# Altium schematic sheet Consult.SchDoc
size A3; SheetNumber: 1; SheetTotal: 1
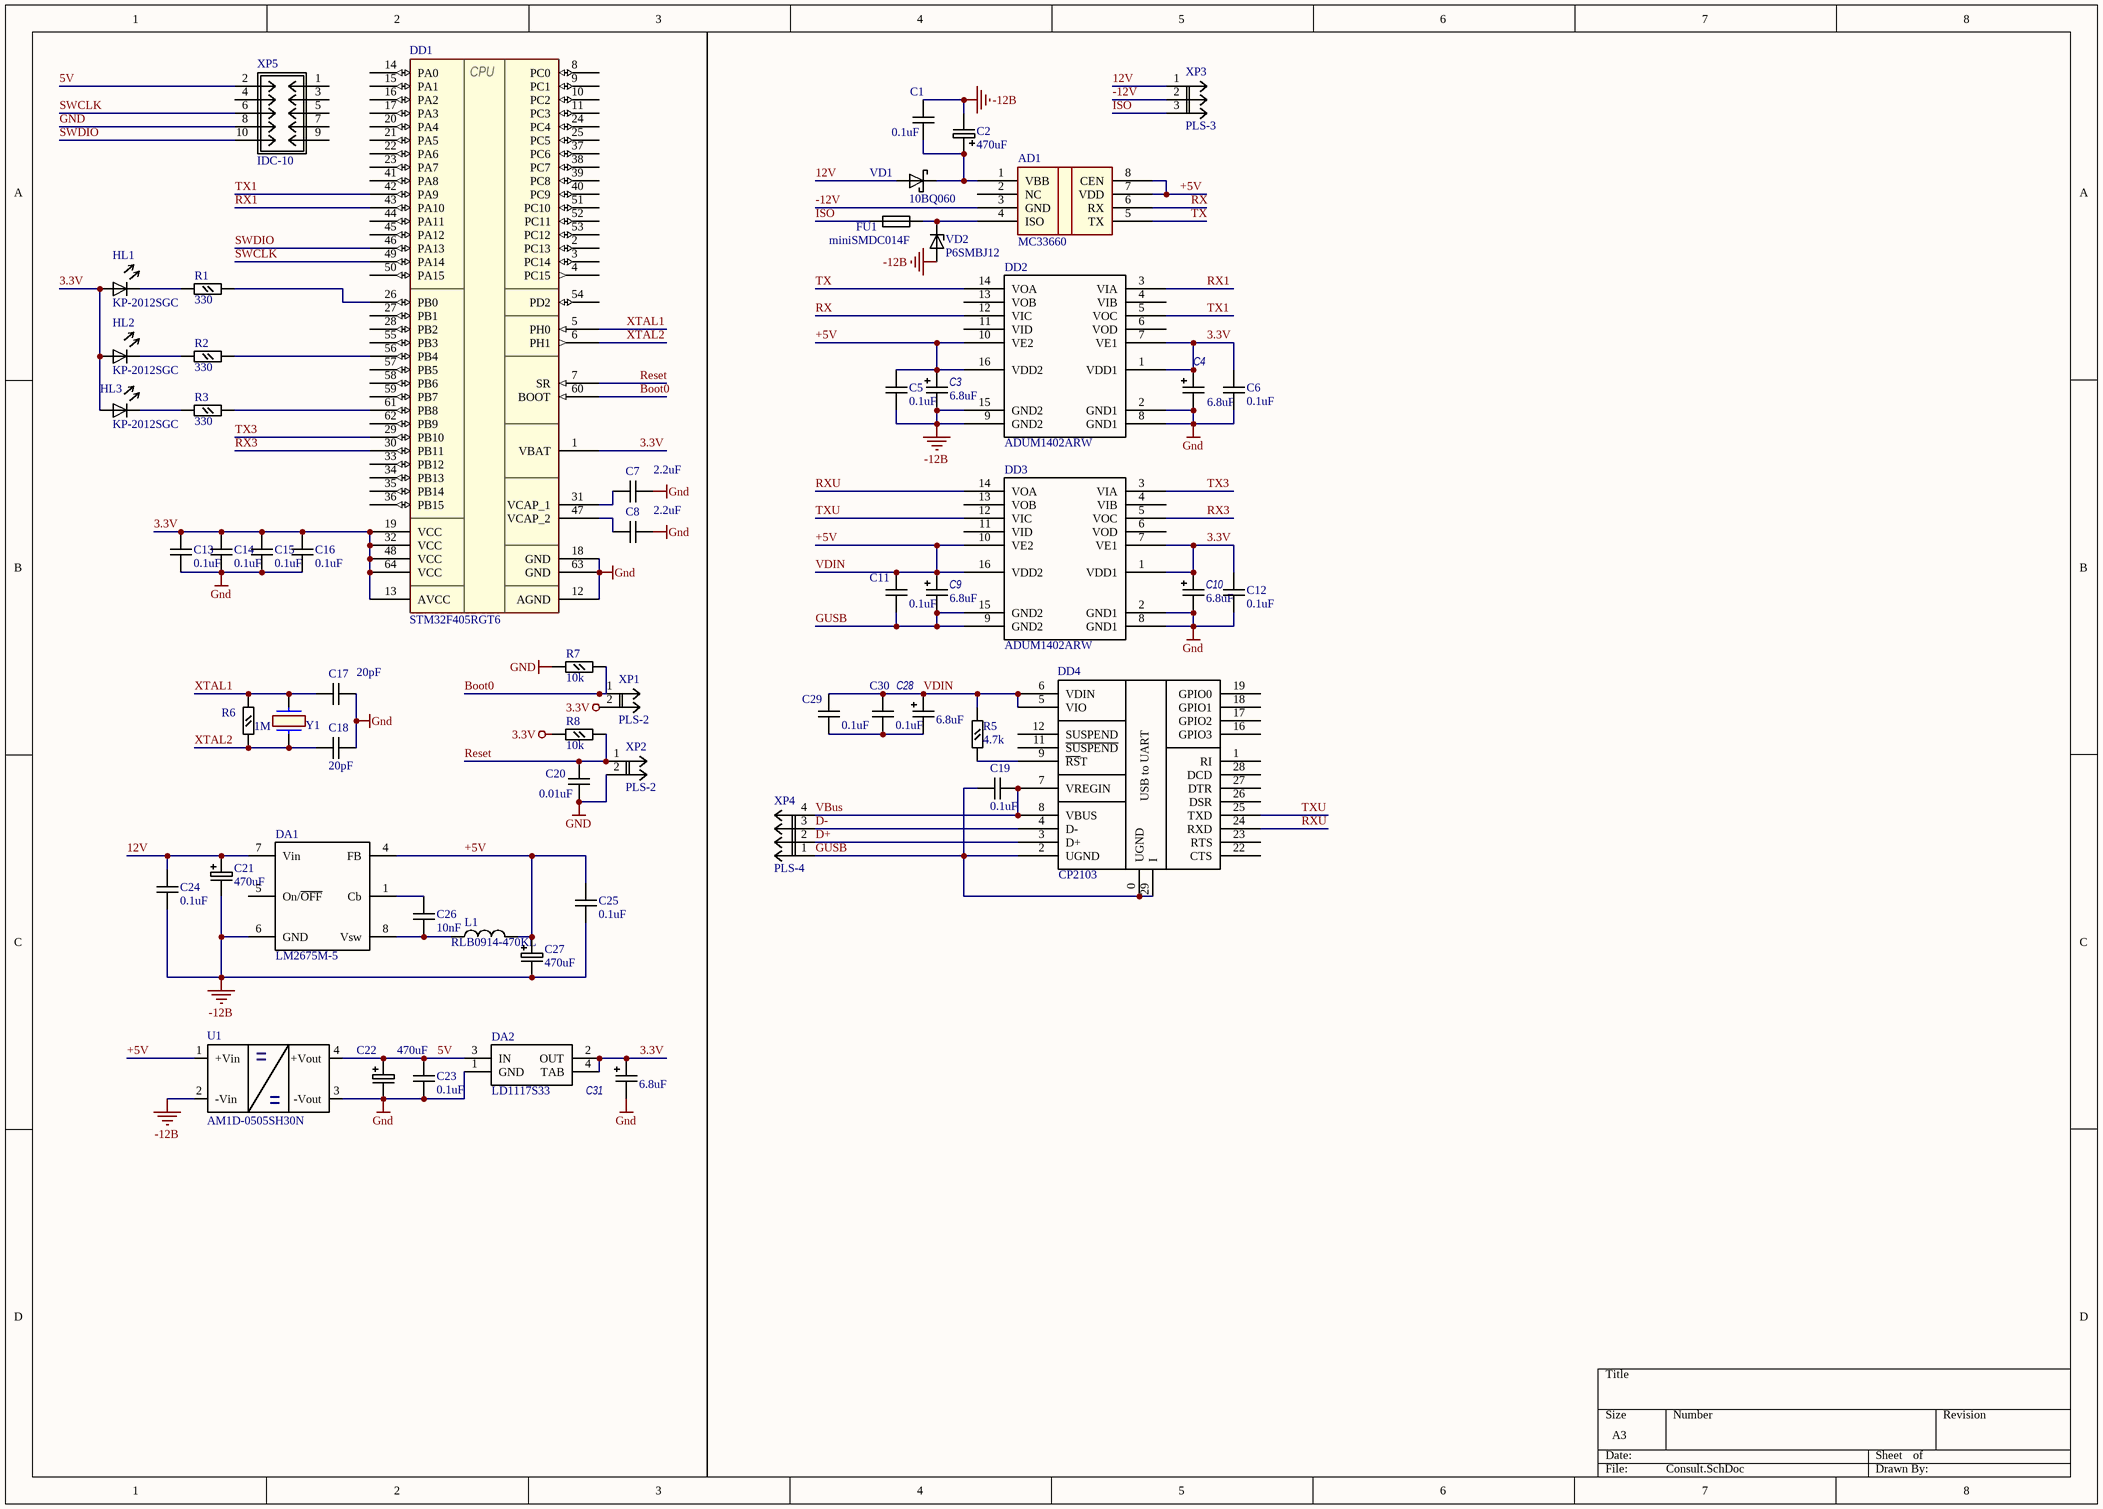
[diagram p0: Consult.SchDoc]

## Parts
AD1  MC33660  [SO-8_M]
C1  0.1uF  [cap0805]
C2  470uF  [ECR-EHR 10mm]
C3  6.8uF  [TC3216-1206-A]
C4  6.8uF  [TC3216-1206-A]
C5  0.1uF  [cap0805]
C6  0.1uF  [cap0805]
C7  2.2uF  [cap0805]
C8  2.2uF  [cap0805]
C9  6.8uF  [TC3216-1206-A]
C10  6.8uF  [TC3216-1206-A]
C11  0.1uF  [cap0805]
C12  0.1uF  [cap0805]
C13  0.1uF  [cap0805]
C14  0.1uF  [cap0805]
C15  0.1uF  [cap0805]
C16  0.1uF  [cap0805]
C17  20pF  [cap0805]
C18  20pF  [cap0805]
C19  0.1uF  [cap0805]
C20  0.01uF  [cap0805]
C21  470uF  [ECR-EHR 10mm]
C22  470uF  [ECR-EHR 10mm]
C23  0.1uF  [cap0805]
C24  0.1uF  [cap0805]
C25  0.1uF  [cap0805]
C26  10nF  [cap0805]
C27  470uF  [ECR-EHR 10mm]
C28  6.8uF  [TC3216-1206-A]
C29  0.1uF  [cap0805]
C30  0.1uF  [cap0805]
C31  6.8uF  [TC3216-1206-A]
DA1  LM2675M-5  [SO-8]
DA2  LD1117S33  [SOT223]
DD1  STM32F405RGT6  [LQFP64]
DD2  ADUM1402ARW  [WSO-16]
DD3  ADUM1402ARW  [WSO-16]
DD4  CP2103  [QFN-28]
FU1  miniSMDC014F  [1812]
HL1  KP-2012SGC  [Led0805]
HL2  KP-2012SGC  [Led0805]
HL3  KP-2012SGC  [Led0805]
L1  RLB0914-470KL  [RLB0914]
R1  330  [res0805]
R2  330  [res0805]
R3  330  [res0805]
R5  4.7k  [res0805]
R6  1M  [res0805]
R7  10k  [res0805]
R8  10k  [res0805]
U1  AM1D-0505SH30N  [SIP7S]
VD1  10BQ060  [SMB]
VD2  P6SMBJ12  [SMB]
XP1  PLS-2  [PLS2]
XP2  PLS-2  [PLS2]
XP3  PLS-3  [PLS3]
XP4  PLS-4  [PLS4]
XP5  IDC-10  [IDC-10]
Y1  8MHz  [XT49M]  (value not drawn)

## Nets
3.3V: C4.1 C6.1 C10.1 C12.1 C13.1 C14.1 C15.1 C16.1 C31.1 DA2.2(OUT) DA2.4(TAB) DD1.1(VBAT) DD1.13(AVCC) DD1.19(VCC) DD1.32(VCC) DD1.48(VCC) DD1.64(VCC) DD2.1(VDD1) DD2.7(VE1) DD3.1(VDD1) DD3.7(VE1) HL1.1(A) HL2.1(A) HL3.1(A) R8.2
+5V: AD1.7(VDD) AD1.8(CEN) C3.1 C5.1 C9.1 C11.1 C25.1 C27.1 C28.1 C29.1 C30.1 DA1.4(FB) DD2.10(VE2) DD2.16(VDD2) DD3.10(VE2) DD3.16(VDD2) DD4.5(VIO) DD4.6(VDIN) DD4.10(VDIN) DD4.13(VDIN) DD4.14(VDIN) DD4.15(VDIN) DD4.20(VDIN) DD4.21(VDIN) L1.2 R5.2 U1.1(+Vin)  [also labelled VDIN]
-12B: C1.2 C2.2 C3.2 C5.2 C21.2 C24.2 C25.2 C27.2 DA1.6(GND) DD2.9(GND2) DD2.15(GND2) U1.2(-Vin) VD2.1(A)
GND: C4.2 C6.2 C7.2 C8.2 C10.2 C12.2 C13.2 C14.2 C15.2 C16.2 C17.2 C18.2 C20.2 C22.2 C23.2 C31.2 DA1.2(GND) DA1.3(GND) DA2.1(GND) DD1.12(AGND) DD1.18(GND) DD1.63(GND) DD2.2(GND1) DD2.8(GND1) DD3.2(GND1) DD3.8(GND1) R7.2 U1.3(-Vout) XP2.2 XP5.8
5V: C22.1 C23.1 DA2.3(IN) U1.4(+Vout) XP5.2
12V: C21.1 C24.1 DA1.7(Vin) VD1.1(A) XP3.1
-12V: AD1.3(GND) XP3.2
Boot0: DD1.60(BOOT) R7.1 XP1.1
D+: DD4.3(D+) XP4.2
D-: DD4.4(D-) XP4.3
GUSB: C9.2 C11.2 C19.1 DD3.9(GND2) DD3.15(GND2) DD4.0(UGND) DD4.2(UGND) DD4.29(I) XP4.1
ISO: FU1.1 XP3.3
Reset: C20.1 DD1.7(SR) R8.1 XP2.1
RX: AD1.6(RX) DD2.12(VIC)
RX1: DD1.43(PA10) DD2.3(VIA)
RX3: DD1.30(PB11) DD3.5(VOC)
RXU: DD3.14(VOA) DD4.24(RXD)
SWCLK: DD1.49(PA14) XP5.6
SWDIO: DD1.46(PA13) XP5.10
TX: AD1.5(TX) DD2.14(VOA)
TX1: DD1.42(PA9) DD2.5(VOC)
TX3: DD1.29(PB10) DD3.3(VIA)
TXU: DD3.12(VIC) DD4.25(TXD)
VBus: C19.2 DD4.7(VREGIN) DD4.8(VBUS) XP4.4
XTAL1: C17.1 DD1.5(PH0) R6.2 Y1.2(L2)
XTAL2: C18.1 DD1.6(PH1) R6.1 Y1.1(L1)
NetAD1_1: AD1.1(VBB) C1.1 C2.1 VD1.2(K)
NetAD1_4: AD1.4(ISO) FU1.2 VD2.2(K)
NetC7_1: C7.1 DD1.31(VCAP_1)
NetC8_1: C8.1 DD1.47(VCAP_2)
NetC26_1: C26.1 DA1.1(Cb)
NetC26_2: C26.2 DA1.8(Vsw) L1.1
NetC28_2: C28.2 C29.2 C30.2
NetDD1_26: DD1.26(PB0) R1.2
NetDD1_56: DD1.56(PB4) R2.2
NetDD1_61: DD1.61(PB8) R3.2
NetDD4_9: DD4.9(~{RS}T) R5.1
NetHL1_2: HL1.2(K) R1.1
NetHL2_2: HL2.2(K) R2.1
NetHL3_2: HL3.2(K) R3.1

Not connected (* = marked no-connect by the designer): AD1 2(NC); DA1 5(On/~{OFF}); DD1 2(PC13) 3(PC14) 4(PC15) 8(PC0) 9(PC1) 10(PC2) 11(PC3) 14(PA0) 15(PA1) 16(PA2) 17(PA3) 20(PA4) 21(PA5) 22(PA6) 23(PA7) 24(PC4) 25(PC5) 27(PB1) 28(PB2) 33(PB12) 34(PB13) 35(PB14) 36(PB15) 37(PC6) 38(PC7) 39(PC8) 40(PC9) 41(PA8) 44(PA11) 45(PA12) 50(PA15) 51(PC10) 52(PC11) 53(PC12) 54(PD2) 55(PB3) 57(PB5) 58(PB6) 59(PB7) 62(PB9); DD2 4(VIB) 6(VOD) 11(VID) 13(VOB); DD3 4(VIB) 6(VOD) 11(VID) 13(VOB); DD4 1(RI) 11(~{SUSPEND}) 12(SUSPEND) 16(GPIO3) 17(GPIO2) 18(GPIO1) 19(GPIO0) 22(CTS) 23(RTS) 26(DSR) 27(DTR) 28(DCD); XP1 2; XP5 1 3 4 5 7 9

## Notes on the sheet
- Labels drawn without touching a wire or pin: 3.3V
- (in symbol CP2103) USB to UART
- (in symbol STM32F405RGT6) CPU

## Library data of the parts
C1 C5-C8 C11-C20 C23-C26 C29 C30 = cap0805: Керамический конденсатор, SMD; Group: Конденсаторы; NPads: 2; Part Number: cap0805; SType: SMD; Package: SMD 0805
  C1 C5 C6 C11-C16 C19 C23-C25 C29 C30: ValueSCH: 0.1uF
  C7 C8: ValueSCH: 2.2uF
  C17 C18: ValueSCH: 20pF
  C20: ValueSCH: 0.01uF
  C26: ValueSCH: 10nF
C2 C21 C22 C27 = ECR/EHR/EXR D=10mm: Алюминиевый конденсатор Hitano; Group: Конденсаторы; SType: TH; NPads: 2; Part Number: ECR/EHR/EXR D=10mm; ValueSCH: 470uF; Package: ECR/HER
C3 C4 C9 C10 C28 C31 = capA: Танталовый конденсатор, SMD; Part Number: capA; Group: Конденсаторы; NPads: 2; ValueSCH: 6.8uF; SType: SMD; Package: SMD A
DA1 = LM2675M-5: Понижающий DC-DC 5V 1А; Group: Микросхемы; SType: SMD; NPads: 8; Part Number: LM2675M-5; ValueSCH: LM2675M-5; Package: SO-8
DA2 = LD1117S33: Линейный стабилизатор 3.3V; Group: Микросхемы; SType: SMD; NPads: 4; Part Number: LD1117S33; ValueSCH: LD1117S33; Package: SOT223
DD1 = STM32F405RGT6: Микроконтроллер 32 бит CORTEX M4; Group: Микросхемы; SType: SMD; NPads: 64; Part Number: STM32F405RGT6; ValueSCH: STM32F405RGT6; Package: LQFP64
DD2 DD3 = ADUM1402ARW: Цифровой оптрон 4 канала; Group: Микросхемы; SType: SMD; NPads: 16; Part Number: ADUM1402ARW; ValueSCH: ADUM1402ARW; Package: SO-16W
DD4 = CP2103: Чип USB -> UART; Group: Микросхемы; SType: SMD; NPads: 28; Part Number: CP2103; ValueSCH: CP2103; Package: QFN-28
FU1 = miniSMDC014F: SMD Предохранитель 0.14А 60B; NPads: 2; Part Number: miniSMDC014F; ValueSCH: miniSMDC014F; Group: Предохранитель; SType: SMD; Package: smd1812
HL1-HL3 = KP-2012SGC: SMD светодиод зеленый; Group: Диоды; NPads: 2; Part Number: KP-2012SGC; ValueSCH: KP-2012SGC; SType: SMD; Package: SMD 0805
L1 = RLB0914-470KL: Group: Индуктивности; SType: TH; NPads: 2; Part Number: RLB0914-470KL; ValueSCH: RLB0914-470KL; Package: RLB0914
R1-R3 R5-R8 = res0805: Резистор 0.125 W, SMD; Group: Резисторы; NPads: 2; Part Number: res0805; SType: SMD; Package: SMD 0805
  R1-R3: ValueSCH: 330
  R5: ValueSCH: 4.7k
  R6: ValueSCH: 1M
  R7 R8: ValueSCH: 10k
U1 = AM1D-0505SH30N: Преобразователь 1Вт 5В ->5В; Group: Микросхемы; SType: TH; NPads: 4; Part Number: AM1D-0505SH30N; ValueSCH: AM1D-0505SH30N; Package: SIP7
VD1 = 10BQ060: Диод шоттки 60V 1A; Group: Диоды; SType: SMD; NPads: 2; Part Number: 10BQ060; ValueSCH: 10BQ060; Package: SMB
VD2 = P6SMBJ12: Супрессор 12В; Group: Диоды; SType: SMD; NPads: 2; Part Number: P6SMBJ12; ValueSCH: P6SMBJ12; Package: SMB
XP1 XP2 = PLS-2: Однорядный штыревой разъем 2 шаг 2.54мм; Group: Разъемы; SType: TH; NPads: 2; Part Number: PLS-2; ValueSCH: PLS-2
XP3 = PLS-3: Однорядный штыревой разъем 3 шаг 2.54мм; Group: Разъемы; SType: TH; NPads: 3; Part Number: PLS-3; ValueSCH: PLS-3
XP4 = PLS-4: Однорядный штыревой разъем 4 шаг 2.54мм; Group: Разъемы; SType: TH; NPads: 4; Part Number: PLS-4; ValueSCH: PLS-4
XP5 = IDC-10: Вилка на плату 5х2 контактов шаг 2.54мм; Group: Разъемы; SType: TH; NPads: 10; Part Number: IDC-10; ValueSCH: IDC-10
Y1 = HC-49/U-S: Кварцевый осциллятор 3.2 - 60 MHz; Group: Резонаторы; SType: TH; NPads: 2; Part Number: HC-49/U-S; ValueSCH: 8MHz; HelpURL: \DATA\HC-49.pdf